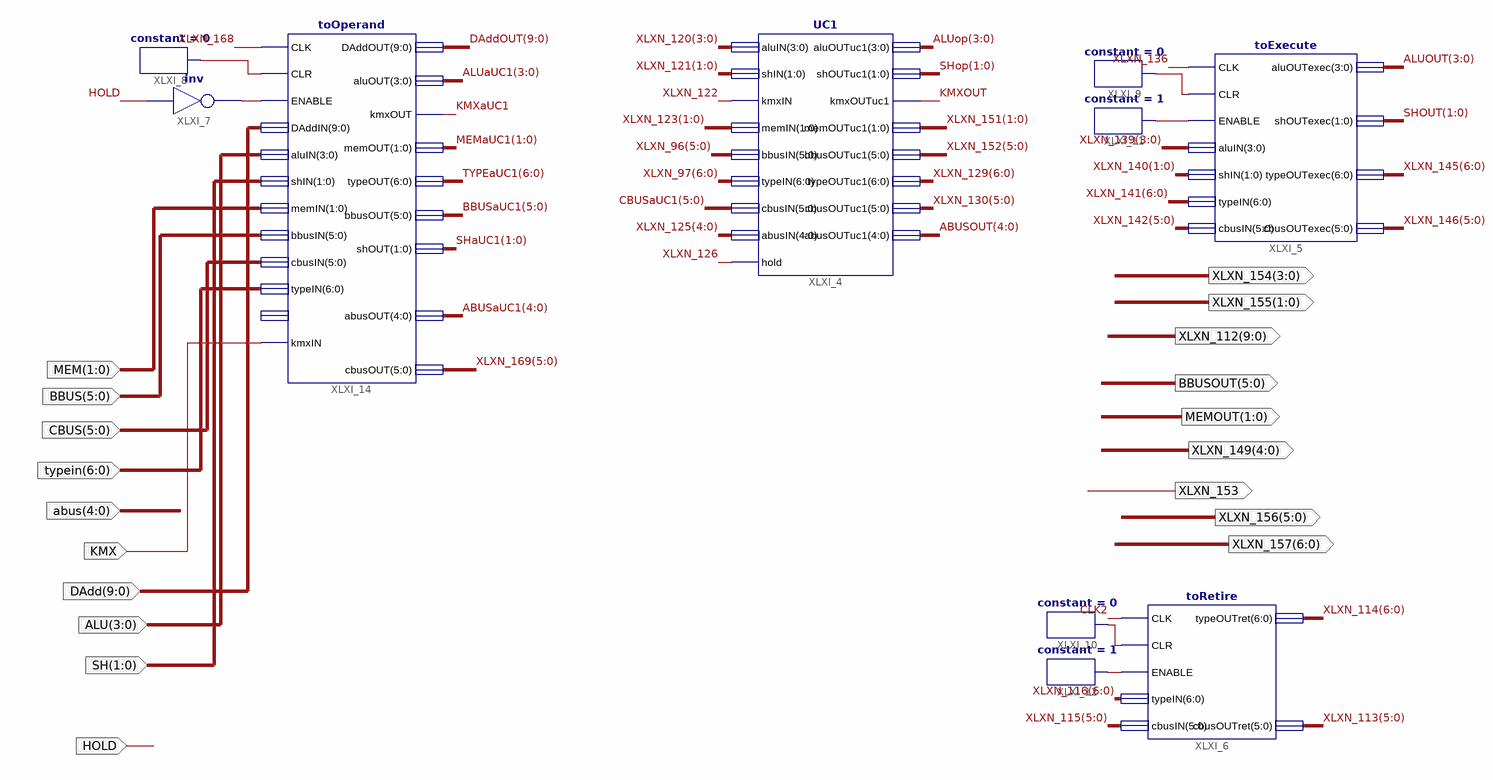
[diagram p0: schematic sheet 1]
// Xilinx ISE schematic test1.sch (artix7) as structural Verilog: 10 symbols, 19 ports
module test1 (
  input  [1:0] MEM,
  input  [5:0] BBUS,
  input  [5:0] CBUS,
  input  [6:0] typein,
  input  [4:0] abus,
  input  KMX,
  input  HOLD,
  input  [9:0] DAdd,
  input  [3:0] ALU,
  input  [1:0] SH,
  output [9:0] XLXN_112,
  output [5:0] BBUSOUT,
  output [1:0] MEMOUT,
  output [4:0] XLXN_149,
  output XLXN_153,
  output [3:0] XLXN_154,
  output [1:0] XLXN_155,
  output [5:0] XLXN_156,
  output [6:0] XLXN_157
);

  wire CLK2, KMXaUC1, KMXOUT, XLXN_2, XLXN_11, XLXN_49, XLXN_50, XLXN_60, XLXN_61, XLXN_122, XLXN_126,
       XLXN_136, XLXN_168;
  wire [1:0] MEMaUC1, SHaUC1, SHop, SHOUT, XLXN_121, XLXN_123, XLXN_140, XLXN_151;
  wire [3:0] ALUaUC1, ALUop, ALUOUT, XLXN_120, XLXN_139;
  wire [4:0] ABUSaUC1, ABUSOUT, XLXN_125;
  wire [5:0] BBUSaUC1, CBUSaUC1, XLXN_96, XLXN_113, XLXN_115, XLXN_130, XLXN_142, XLXN_146, XLXN_152,
       XLXN_169;
  wire [6:0] TYPEaUC1, XLXN_97, XLXN_114, XLXN_116, XLXN_129, XLXN_141, XLXN_145;
  wire [9:0] DAddOUT;

  not XLXI_7 (XLXN_2, HOLD);
  constant #(.CValue("0")) XLXI_8 (.O(XLXN_11));
  constant #(.CValue("1")) XLXI_12 (.O(XLXN_61));
  constant #(.CValue("0")) XLXI_10 (.O(XLXN_60));
  toRetire XLXI_6 (
    .CLK(CLK2), .CLR(XLXN_60), .ENABLE(XLXN_61), .typeIN(XLXN_116), .cbusIN(XLXN_115), .typeOUTret(XLXN_114),
    .cbusOUTret(XLXN_113));
  UC1 XLXI_4 (
    .aluIN(XLXN_120), .shIN(XLXN_121), .kmxIN(XLXN_122), .memIN(XLXN_123), .bbusIN(XLXN_96),
    .typeIN(XLXN_97), .cbusIN(CBUSaUC1), .abusIN(XLXN_125), .hold(XLXN_126), .aluOUTuc1(ALUop),
    .shOUTuc1(SHop), .kmxOUTuc1(KMXOUT), .memOUTuc1(XLXN_151), .bbusOUTuc1(XLXN_152), .typeOUTuc1(XLXN_129),
    .cbusOUTuc1(XLXN_130), .abusOUTuc1(ABUSOUT));
  toExecute XLXI_5 (
    .CLK(XLXN_136), .CLR(XLXN_49), .ENABLE(XLXN_50), .aluIN(XLXN_139), .shIN(XLXN_140), .typeIN(XLXN_141),
    .cbusIN(XLXN_142), .aluOUTexec(ALUOUT), .shOUTexec(SHOUT), .typeOUTexec(XLXN_145), .cbusOUTexec(XLXN_146));
  constant #(.CValue("1")) XLXI_11 (.O(XLXN_50));
  constant #(.CValue("0")) XLXI_9 (.O(XLXN_49));
  toOperand XLXI_14 (
    .CLK(XLXN_168), .CLR(XLXN_11), .ENABLE(XLXN_2), .DAddIN(DAdd), .aluIN(ALU), .shIN(SH), .memIN(MEM),
    .bbusIN(BBUS), .cbusIN(CBUS), .typeIN(typein), .kmxIN(KMX), .DAddOUT(DAddOUT), .aluOUT(ALUaUC1),
    .kmxOUT(KMXaUC1), .memOUT(MEMaUC1), .typeOUT(TYPEaUC1), .bbusOUT(BBUSaUC1), .shOUT(SHaUC1),
    .abusOUT(ABUSaUC1), .cbusOUT(XLXN_169));  // open: abusIN
endmodule
